# Altium schematic sheet PAGE09 Connectors.SchDoc
size 420 x 297 mm; SheetNumber: 9; SheetTotal: 9
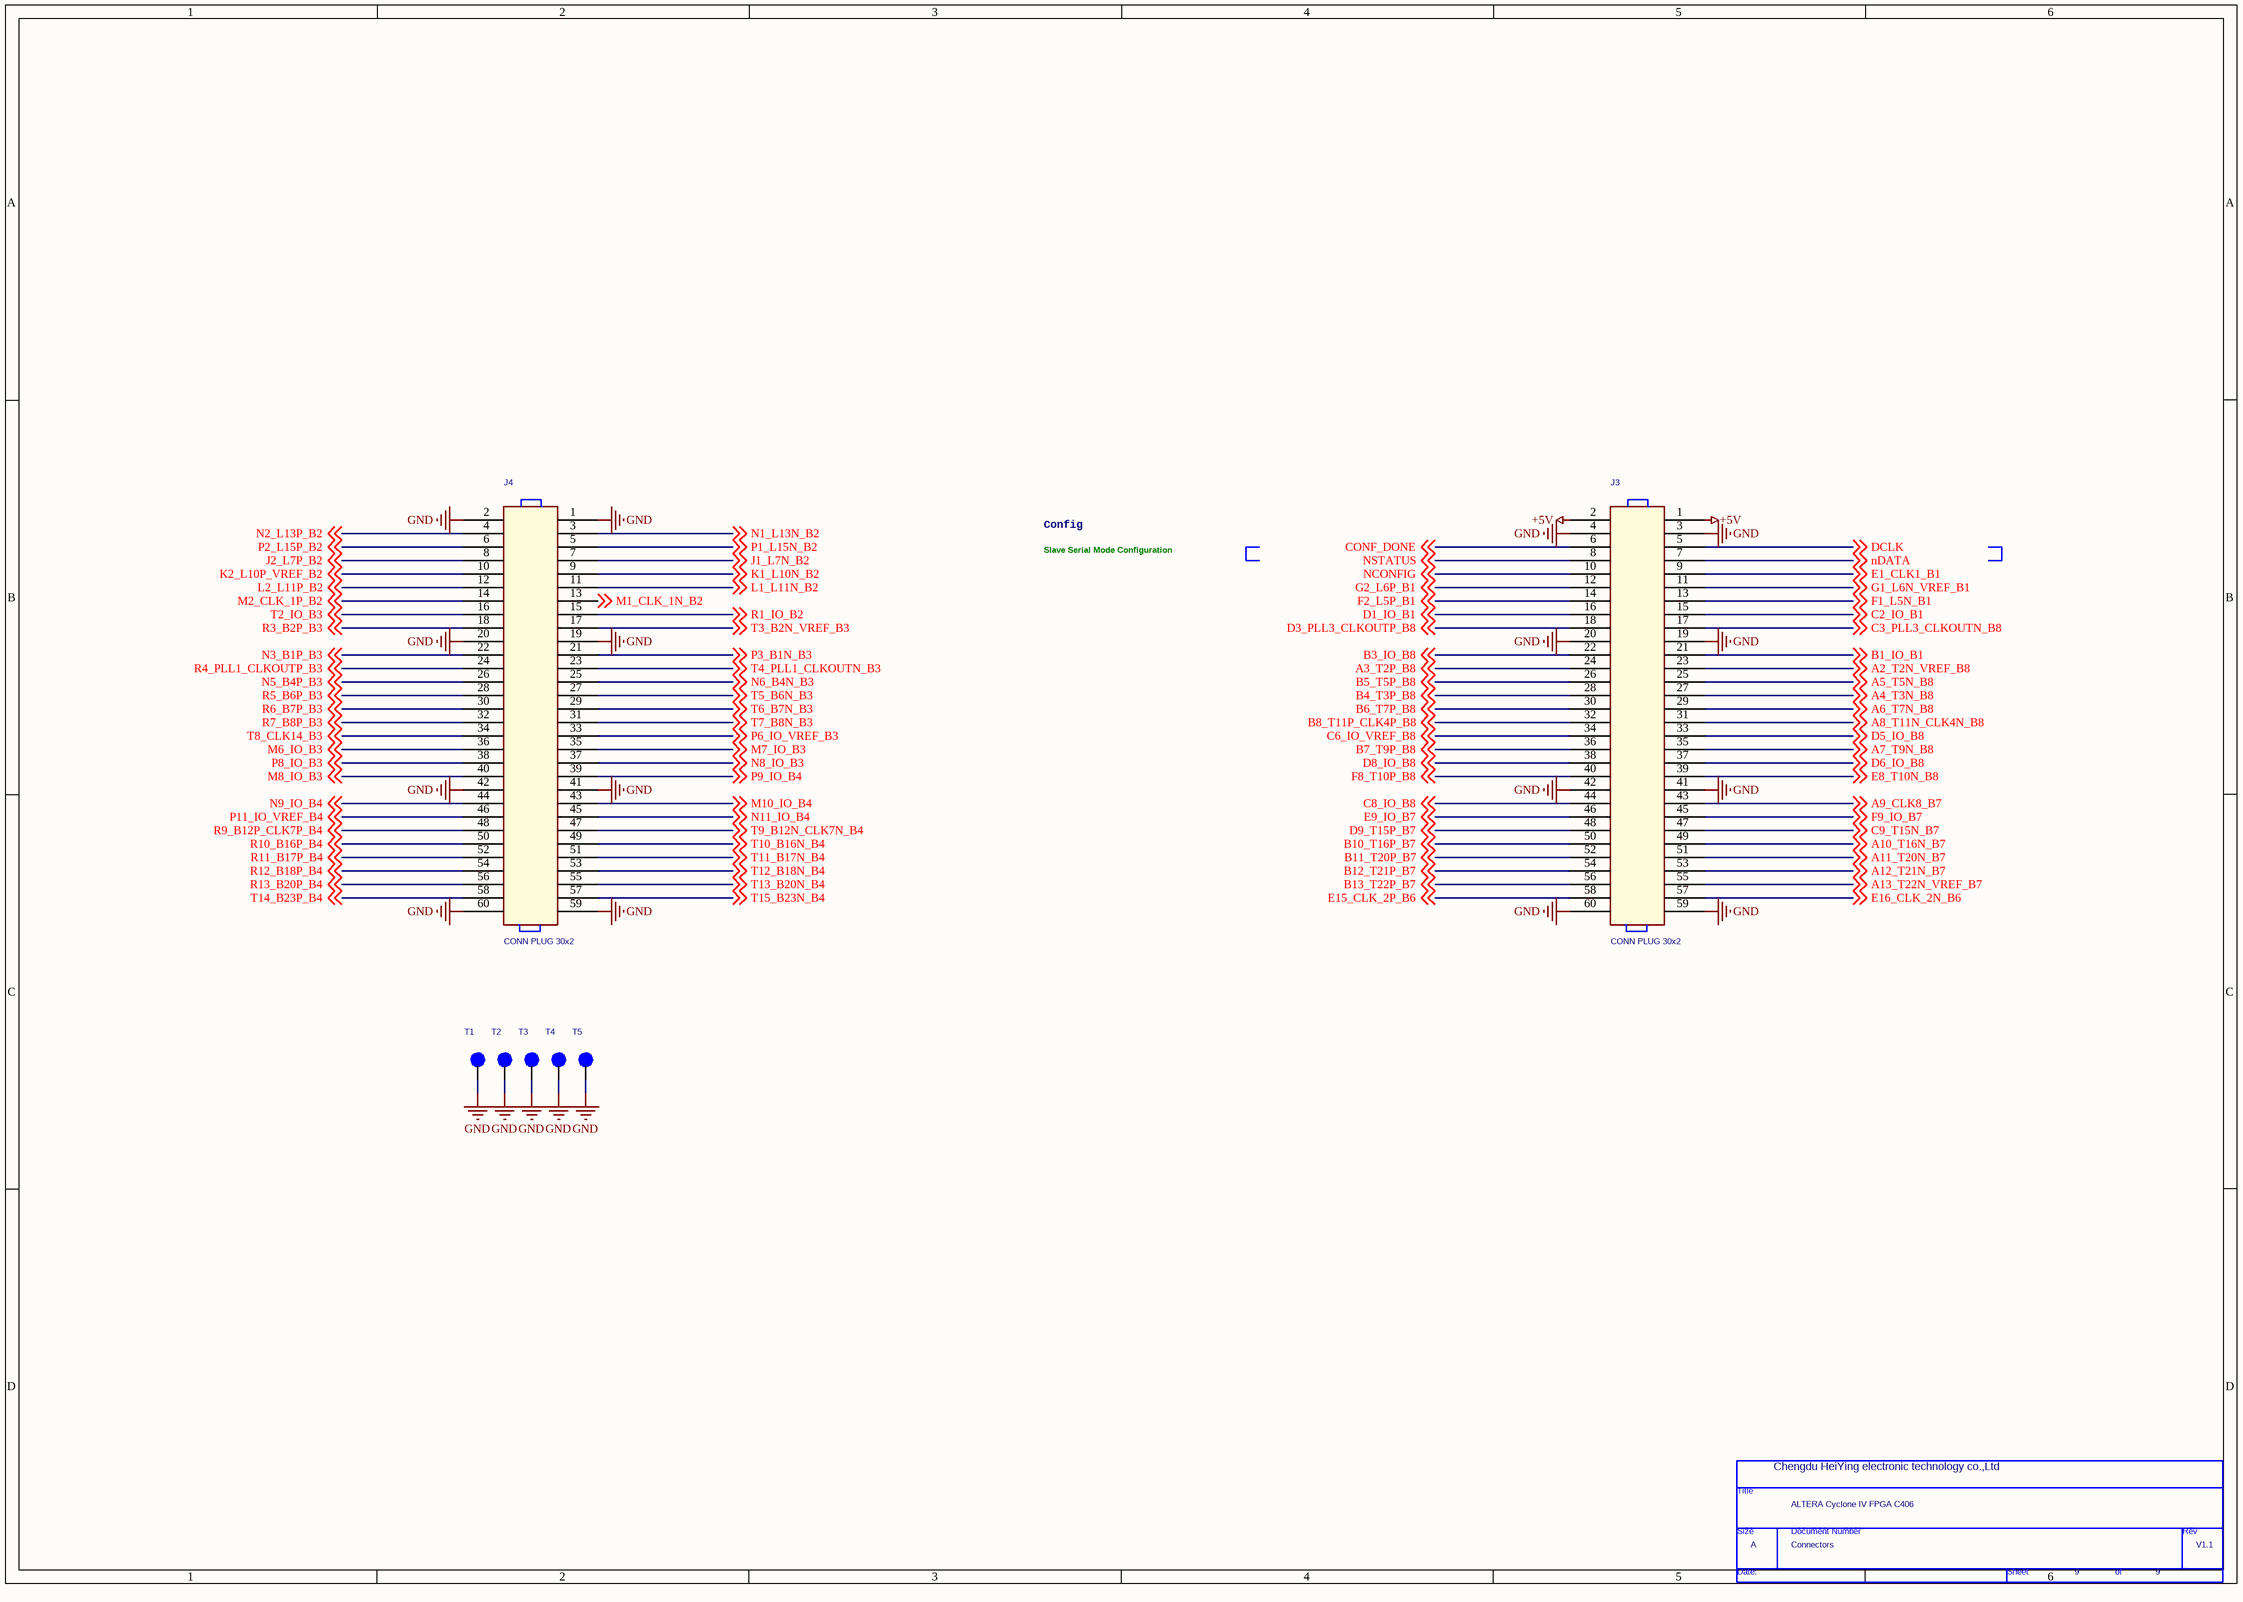
[diagram p0: PAGE09 Connectors.SchDoc]

## Parts
*  Page Count: 9  Page Size: A  Title: ALTERA Cyclone IV FPGA C406  RevCode: V1.1  Doc: Connectors  (hidden comment: TitleBlock0)  (graphical)
J3  CONN PLUG 30x2  [DIP2X30_2P54]
J4  CONN PLUG 30x2  [DIP2X30_2P54]
T1  TPAD_015  [TP_OBL1_4X0_6]  (value not drawn)
T2  TPAD_015  [TP_OBL1_4X0_6]  (value not drawn)
T3  TPAD_015  [TP_OBL1_4X0_6]  (value not drawn)
T4  TPAD_015  [TP_OBL1_4X0_6]  (value not drawn)
T5  TPAD_015  [TP_OBL1_4X0_6]  (value not drawn)

## Nets
+5V: J3.1 J3.2
GND: J3.3 J3.4 J3.19 J3.20 J3.41 J3.42 J3.59 J3.60 J4.1 J4.2 J4.19 J4.20 J4.41 J4.42 J4.59 J4.60 T1.1(Pin1) T2.1(Pin1) T3.1(Pin1) T4.1(Pin1) T5.1(Pin1)
A2_T2N_VREF_B8: J3.23 ; off-sheet A2_T2N_VREF_B8
A3_T2P_B8: J3.24 ; off-sheet A3_T2P_B8
A4_T3N_B8: J3.27 ; off-sheet A4_T3N_B8
A5_T5N_B8: J3.25 ; off-sheet A5_T5N_B8
A6_T7N_B8: J3.29 ; off-sheet A6_T7N_B8
A7_T9N_B8: J3.35 ; off-sheet A7_T9N_B8
A8_T11N_CLK4N_B8: J3.31 ; off-sheet A8_T11N_CLK4N_B8
A9_CLK8_B7: J3.43 ; off-sheet A9_CLK8_B7
A10_T16N_B7: J3.49 ; off-sheet A10_T16N_B7
A11_T20N_B7: J3.51 ; off-sheet A11_T20N_B7
A12_T21N_B7: J3.53 ; off-sheet A12_T21N_B7
A13_T22N_VREF_B7: J3.55 ; off-sheet A13_T22N_VREF_B7
B1_IO_B1: J3.21 ; off-sheet B1_IO_B1
B3_IO_B8: J3.22 ; off-sheet B3_IO_B8
B4_T3P_B8: J3.28 ; off-sheet B4_T3P_B8
B5_T5P_B8: J3.26 ; off-sheet B5_T5P_B8
B6_T7P_B8: J3.30 ; off-sheet B6_T7P_B8
B7_T9P_B8: J3.36 ; off-sheet B7_T9P_B8
B8_T11P_CLK4P_B8: J3.32 ; off-sheet B8_T11P_CLK4P_B8
B10_T16P_B7: J3.50 ; off-sheet B10_T16P_B7
B11_T20P_B7: J3.52 ; off-sheet B11_T20P_B7
B12_T21P_B7: J3.54 ; off-sheet B12_T21P_B7
B13_T22P_B7: J3.56 ; off-sheet B13_T22P_B7
C2_IO_B1: J3.15 ; off-sheet C2_IO_B1
C3_PLL3_CLKOUTN_B8: J3.17 ; off-sheet C3_PLL3_CLKOUTN_B8
C6_IO_VREF_B8: J3.34 ; off-sheet C6_IO_VREF_B8
C8_IO_B8: J3.44 ; off-sheet C8_IO_B8
C9_T15N_B7: J3.47 ; off-sheet C9_T15N_B7
CONF_DONE: J3.6 ; off-sheet CONF_DONE
D1_IO_B1: J3.16 ; off-sheet D1_IO_B1
D3_PLL3_CLKOUTP_B8: J3.18 ; off-sheet D3_PLL3_CLKOUTP_B8
D5_IO_B8: J3.33 ; off-sheet D5_IO_B8
D6_IO_B8: J3.37 ; off-sheet D6_IO_B8
D8_IO_B8: J3.38 ; off-sheet D8_IO_B8
D9_T15P_B7: J3.48 ; off-sheet D9_T15P_B7
DCLK: J3.5 ; off-sheet DCLK
E1_CLK1_B1: J3.9 ; off-sheet E1_CLK1_B1
E8_T10N_B8: J3.39 ; off-sheet E8_T10N_B8
E9_IO_B7: J3.46 ; off-sheet E9_IO_B7
E15_CLK_2P_B6: J3.58 ; off-sheet E15_CLK_2P_B6
E16_CLK_2N_B6: J3.57 ; off-sheet E16_CLK_2N_B6
F1_L5N_B1: J3.13 ; off-sheet F1_L5N_B1
F2_L5P_B1: J3.14 ; off-sheet F2_L5P_B1
F8_T10P_B8: J3.40 ; off-sheet F8_T10P_B8
F9_IO_B7: J3.45 ; off-sheet F9_IO_B7
G1_L6N_VREF_B1: J3.11 ; off-sheet G1_L6N_VREF_B1
G2_L6P_B1: J3.12 ; off-sheet G2_L6P_B1
J1_L7N_B2: J4.7 ; off-sheet J1_L7N_B2
J2_L7P_B2: J4.8 ; off-sheet J2_L7P_B2
K1_L10N_B2: J4.9 ; off-sheet K1_L10N_B2
K2_L10P_VREF_B2: J4.10 ; off-sheet K2_L10P_VREF_B2
L1_L11N_B2: J4.11 ; off-sheet L1_L11N_B2
L2_L11P_B2: J4.12 ; off-sheet L2_L11P_B2
M1_CLK_1N_B2: J4.13 ; off-sheet M1_CLK_1N_B2
M2_CLK_1P_B2: J4.14 ; off-sheet M2_CLK_1P_B2
M6_IO_B3: J4.36 ; off-sheet M6_IO_B3
M7_IO_B3: J4.35 ; off-sheet M7_IO_B3
M8_IO_B3: J4.40 ; off-sheet M8_IO_B3
M10_IO_B4: J4.43 ; off-sheet M10_IO_B4
N1_L13N_B2: J4.3 ; off-sheet N1_L13N_B2
N2_L13P_B2: J4.4 ; off-sheet N2_L13P_B2
N3_B1P_B3: J4.22 ; off-sheet N3_B1P_B3
N5_B4P_B3: J4.26 ; off-sheet N5_B4P_B3
N6_B4N_B3: J4.25 ; off-sheet N6_B4N_B3
N8_IO_B3: J4.37 ; off-sheet N8_IO_B3
N9_IO_B4: J4.44 ; off-sheet N9_IO_B4
N11_IO_B4: J4.45 ; off-sheet N11_IO_B4
NCONFIG: J3.10 ; off-sheet NCONFIG
nDATA: J3.7 ; off-sheet nDATA
NSTATUS: J3.8 ; off-sheet NSTATUS
P1_L15N_B2: J4.5 ; off-sheet P1_L15N_B2
P2_L15P_B2: J4.6 ; off-sheet P2_L15P_B2
P3_B1N_B3: J4.21 ; off-sheet P3_B1N_B3
P6_IO_VREF_B3: J4.33 ; off-sheet P6_IO_VREF_B3
P8_IO_B3: J4.38 ; off-sheet P8_IO_B3
P9_IO_B4: J4.39 ; off-sheet P9_IO_B4
P11_IO_VREF_B4: J4.46 ; off-sheet P11_IO_VREF_B4
R1_IO_B2: J4.15 ; off-sheet R1_IO_B2
R3_B2P_B3: J4.18 ; off-sheet R3_B2P_B3
R4_PLL1_CLKOUTP_B3: J4.24 ; off-sheet R4_PLL1_CLKOUTP_B3
R5_B6P_B3: J4.28 ; off-sheet R5_B6P_B3
R6_B7P_B3: J4.30 ; off-sheet R6_B7P_B3
R7_B8P_B3: J4.32 ; off-sheet R7_B8P_B3
R9_B12P_CLK7P_B4: J4.48 ; off-sheet R9_B12P_CLK7P_B4
R10_B16P_B4: J4.50 ; off-sheet R10_B16P_B4
R11_B17P_B4: J4.52 ; off-sheet R11_B17P_B4
R12_B18P_B4: J4.54 ; off-sheet R12_B18P_B4
R13_B20P_B4: J4.56 ; off-sheet R13_B20P_B4
T2_IO_B3: J4.16 ; off-sheet T2_IO_B3
T3_B2N_VREF_B3: J4.17 ; off-sheet T3_B2N_VREF_B3
T4_PLL1_CLKOUTN_B3: J4.23 ; off-sheet T4_PLL1_CLKOUTN_B3
T5_B6N_B3: J4.27 ; off-sheet T5_B6N_B3
T6_B7N_B3: J4.29 ; off-sheet T6_B7N_B3
T7_B8N_B3: J4.31 ; off-sheet T7_B8N_B3
T8_CLK14_B3: J4.34 ; off-sheet T8_CLK14_B3
T9_B12N_CLK7N_B4: J4.47 ; off-sheet T9_B12N_CLK7N_B4
T10_B16N_B4: J4.49 ; off-sheet T10_B16N_B4
T11_B17N_B4: J4.51 ; off-sheet T11_B17N_B4
T12_B18N_B4: J4.53 ; off-sheet T12_B18N_B4
T13_B20N_B4: J4.55 ; off-sheet T13_B20N_B4
T14_B23P_B4: J4.58 ; off-sheet T14_B23P_B4
T15_B23N_B4: J4.57 ; off-sheet T15_B23N_B4

## Notes on the sheet
- Config
- Slave Serial Mode Configuration
- (near *) Chengdu HeiYing electronic technology co.,Ltd
- (in symbol TitleBlock0) Title; Size; Document Number; Rev; Date:; Sheet; of

## Library data of the parts
T1 T2 T4 = TESTLOOP: TEST POINT PAD 15MIL DIA SMT, NO PART TO ORDER; CLASS: IO; CAD_APPROVED: Yes; ASSY_OPT: DNP; MFG_PN01: NOTACOMPONENT; AGILE_PN: 211-76645; HEIGHT: 0.1MM; ROHS: Yes; MFG_NAME01: NOTACOMPONENT
T3 T5 = TESTLOOP: TEST POINT PAD 15MIL DIA SMT, NO PART TO ORDER; CLASS: IO; AGILE_PN: 211-76645; MFG_NAME01: NOTACOMPONENT; ASSY_OPT: DNP; CAD_APPROVED: Yes; MFG_PN01: NOTACOMPONENT; ROHS: Yes; HEIGHT: 0.1MM
* = TitleBlock0: Page Number: 9; Page Create Date: March  8, 1995